# EAGLE design Lora-Breakout-SMD (EAGLE 7.3.0)
ABBREV: rf1; PROJECT: RFM12B Board
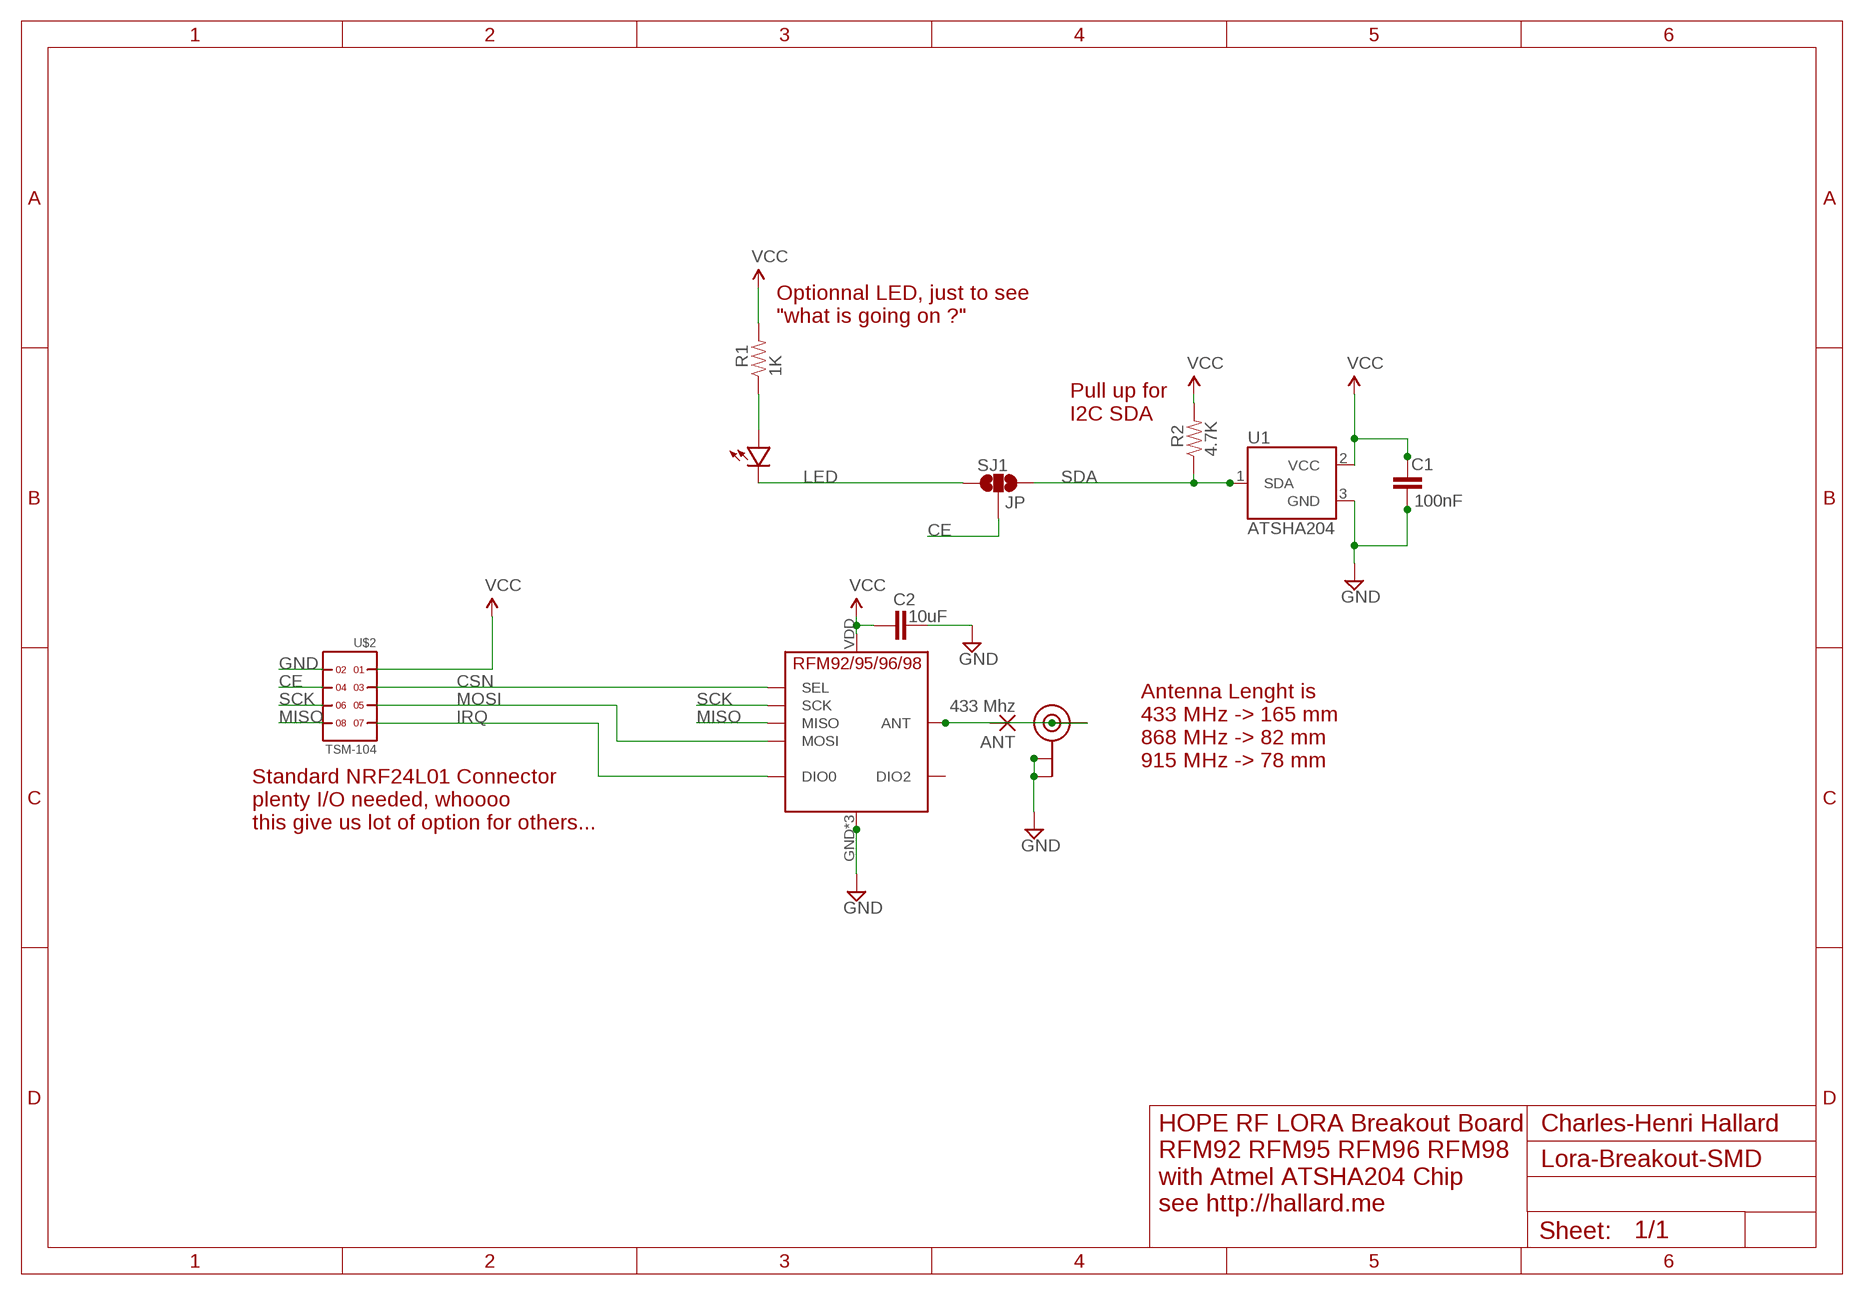
[diagram p0: schematic, sheet 1]

## Parts
ANT  433 Mhz  1,6/0,8  [1,6/0,8]
C1  100nF  CAP0805-CAP  [0805-CAP]
C2  10uF  CAP0805-CAP  [0805-CAP]
R1  1K  RESISTOR0805-RES  [0805-RES]
R2  4.7K  RESISTOR0805-RES  [0805-RES]
SJ1  JP  JUMPER-PAD-3-NOYES_SILK  [PAD-JUMPER-3-NO_YES_SILK]
U1  ATSHA204  ATSHA204-TSU  [SOT23-3]
U$1  LED0805-LARGE  [0805-LED-LARGEPADS]
U$2  TSM-104  [TSM-104]
U$3  RFM95  [RFM95]
U-FL  U.FL  [U.FL]

## Nets
CE: SJ1.2 U$2.4
CSN: U$2.3 U$3.NSS(SEL)
GND [power]: C1.2 C2.2 U1.3(GND) U$2.2 U$3.GND U$3.GND1(GND) U$3.GND2(GND) U-FL.1(GND) U-FL.2(GND)
IRQ: U$2.7 U$3.DIO0
LED: SJ1.1 U$1.MINUS
MISO: U$2.8 U$3.MISO
MOSI: U$2.5 U$3.MOSI
N$1: ANT.1(P) U$3.ANT U-FL.3(SIGNAL)
N$2: R1.1 U$1.PLUS
SCK: U$2.6 U$3.SCK
SDA: R2.1 SJ1.3 U1.1(SDA)
VCC [power]: C1.1 C2.1 R1.2 R2.2 U1.2(VCC) U$2.1 U$3.VDD(VCC)
Unconnected: U$3.DIO2

## Notes on the sheet
- Optionnal LED, just to see
  "what is going on ?"
- Pull up for
  I2C SDA
- Antenna Lenght is
  433 MHz -> 165 mm
  868 MHz -> 82 mm
  915 MHz -> 78 mm
- Standard NRF24L01 Connector
  plenty I/O needed, whoooo
  this give us lot of option for others...
- Charles-Henri Hallard
- HOPE RF LORA Breakout Board
  RFM92 RFM95 RFM96 RFM98 
  with Atmel ATSHA204 Chip 
  see http://hallard.me

## Library data of the parts
ANT = JeeLabs:1,6/0,8: THROUGH-HOLE PAD
C1 C2 = _c2h:CAP: Capacitor Standard 0603 ceramic capacitor, and 0.1" leaded capacitor.
R1 R2 = _c2h:RESISTOR: Resistor Basic schematic elements and footprints for 0603, 1206, and PTH resistors.
SJ1 = SparkFun-Passives:JUMPER-PAD-3-NO
U1 = SparkFun-DigitalIC:ATSHA204: Atmel ATSHA204 The Atmel ATSHA204 is an optimized authentication chip that includes a 4.5Kb EEPROM. This array can be used for storage of keys, miscellaneous read/write, read-only, password or secret data, and consumption tracking. Access to the various sections of memory can be restricted in a variety of ways and then the configuration locked to prevent changes.
U$1 = _c2h:LED
U$2 = _c2h:TSM-104
U$3 = _c2h:RFM95
U-FL = microbuilder:U.FL: U.FL Antenna Connector

## Net classes
1 power: width 0.203 mm, drill 0.305 mm, clearance 0.152 mm

## Board
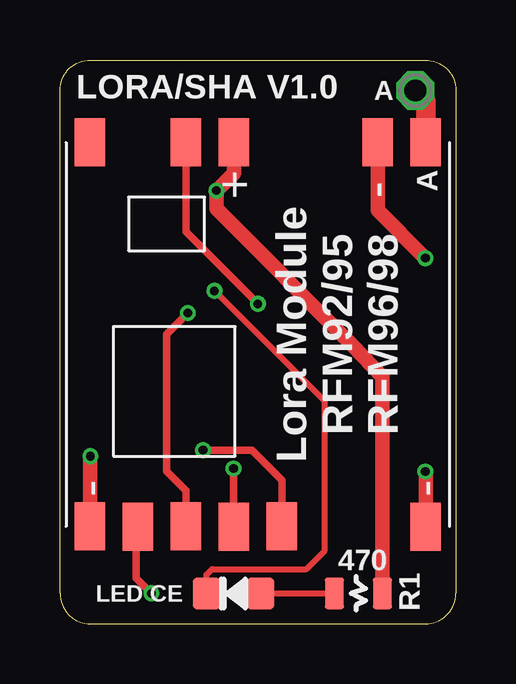
[diagram p1: board, top side]
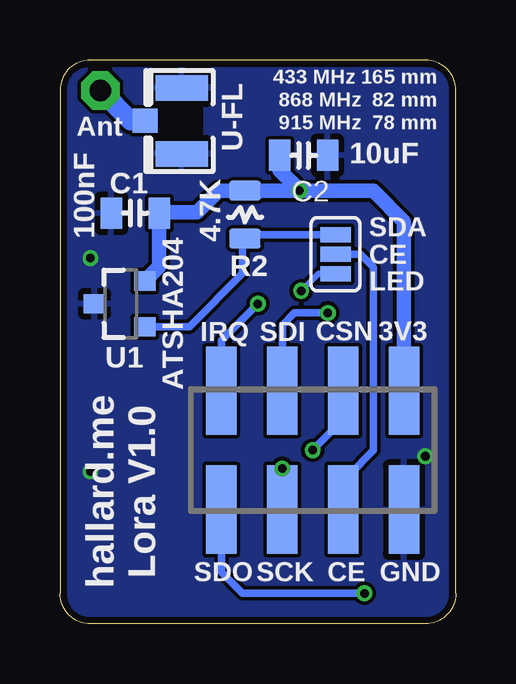
[diagram p2: board, bottom side, seen from below]

Size 16.51 x 23.5 mm. Coordinates in mm from the lower left corner, seen from the top.
Outline: 0,22.23 0,1.27 arc90 1.27,0 15.24,0 arc90 16.51,1.27 16.51,22.23
Outline: 0,22.23 0,22.28
Outline: 16.51,22.28 16.51,22.23
Outline: 0,22.23 arc-90 1.27,23.5 15.24,23.5 arc-90 16.51,22.23
Copper layers (1*16): Top 0.035mm / dielectric 1.5mm / Bottom 0.035mm
Design rules "SeeedStudio_2layer_DRU_no_angle_20140221": minimum track width 6mil, minimum drill 12mil, track to track 6mil, track to pad 6mil, pad to pad 6mil, via to via 6mil, smd to smd 0mil, copper to edge 10mil, drill to drill 10mil, minimum pad ring 10mil, minimum via ring 6mil, stop-mask expansion 2mil, vias tented up to drill 100mil, thermal gap 10mil

### Footprints (pad centres in the part's own frame; a part is rotated, then mirrored left to right if it is on the bottom)
1,6/0,8 = drill 0.9 pad 1.6 octagon: 1 0,0
0805-CAP = smd 0.902 x 1.3: 1 -1,0; 2 1,0
0805-RES = smd 0.8 x 1.3: 1 -1,0; 2 1,0
PAD-JUMPER-3-NO_YES_SILK = smd 0.635 x 1.27: 1 -0.813,0; 2 0,0; 3 0.813,0
SOT23-3 = smd 0.8 x 0.9: 1 -0.95,-1; 2 0.95,-1; 3 0,1.1
0805-LED-LARGEPADS = smd 1.156 x 1.3: MINUS -1.127,0; PLUS 1.127,0
TSM-104 = smd 1.27 x 3.683: 1 -3.81,-2.477; 2 -3.81,2.477; 3 -1.27,-2.477; 4 -1.27,2.477; 5 1.27,-2.477; 6 1.27,2.477; 7 3.81,-2.477; 8 3.81,2.477
RFM95 = smd 2 x 1.27: ANT 5.777,-7; DIO0 5.777,3; DIO2 5.779,7; GND 5.777,-5; GND1 -10.223,7; GND2 -10.23,-7; MISO -10.23,5; MOSI -10.225,3; NSS -10.223,-1; SCK -10.23,1.012; VDD 5.777,1
U.FL = smd 2.2 x 1.05: 1 0,1.375; 2 0,-1.375 | smd 1.05 x 1: 3 1.525,0

### Placement (x,y rotation side)
ANT  14.82,22.23 0 top
C1  13.37,17.11 180 bottom
C2  6.35,19.53 0 bottom
R1  12.45,1.27 0 top
R2  8.79,17.05 90 bottom
SJ1  5.02,15.4 90 bottom
U1  13.97,13.34 90 bottom
U$1  7.24,1.27 0 top
U$2  5.97,7.24 180 bottom
U$3  8.26,14.29 90 top
U-FL  11.43,20.95 180 bottom

### Tracks (layer width: path | path; a pad name or v marks a point on that pad's centre or on a via)
CE
  Bottom 0.305: U$2.4 4.7,5.46 4.45,5.71 4.45,6.22 3.43,7.24 3.43,14.86 3.97,15.4 SJ1.2
CSN  (via drill 0.36)
  Top 0.305: v5.97,7.24 8,7.24 9.26,5.99 U$3.NSS
  Bottom 0.305: U$2.3 4.7,8.51 v5.97,7.24
GND  (via drill 0.36)
  Top 0.61: U$3.GND2 15.26,6.33 v15.24,6.35 | U$3.GND 13.26,17.23 v15.24,15.24 | U$3.GND1 1.25,6.97 v1.27,6.99
  pour Bottom: -1.08,-1.08 -1.08,23.86 17.84,23.86 17.84,-1.08
IRQ  (via drill 0.36)
  Top 0.305: v8.26,13.34 5.25,16.34 U$3.DIO0
  Bottom 0.305: U$2.7 9.78,11.81 v8.26,13.34
LED  (via drill 0.36)
  Top 0.254: U$1.MINUS 6.11,2.05 6.35,2.29 10.29,2.29 11.05,3.05 11.05,9.27 v6.45,13.88
  Bottom 0.254: v6.45,13.88 5.71,14.61 5.26,14.61 SJ1.1
MISO  (via drill 0.36)
  Top 0.305: 3.17,4.14 U$3.MISO 3.17,3.98 3.17,1.91 v3.81,1.27
  Bottom 0.305: U$2.8 9.78,2.16 8.89,1.27 v3.81,1.27
MOSI  (via drill 0.36)
  Top 0.305: 5.08,4.45 5.25,4.27 U$3.MOSI 5.25,5.54 4.45,6.35 4.45,12.06 v5.33,12.95
  Bottom 0.305: v5.33,12.95 6.73,12.95 7.24,12.45 U$2.5
N$1
  Top 0.813: U$3.ANT 15.26,21.79 ANT.1
  Bottom 0.813: U-FL.3 13.55,20.95 ANT.1
N$2
  Top 0.254: U$1.PLUS R1.1
SCK  (via drill 0.36)
  Top 0.305: 7.24,4.32 U$3.SCK v7.24,6.48
  Bottom 0.305: v7.24,6.48 U$2.6
SDA
  Bottom 0.305: SJ1.3 8.96,16.21 R2.1 8.89,16.14 8.89,14.61 11.11,12.38 U1.1
VCC  (via drill 0.36)
  Top 0.61: R1.2 13.45,10.3 12.21,11.6 6.53,17.29 v6.53,18.05 7.25,18.78 U$3.VDD
  Bottom 0.61: U$2.1 2.16,16.76 3.44,18.05 v6.53,18.05 | U1.2 12.37,14.89 C1.1 12.34,17.14 10.79,17.14 9.89,18.05 R2.2 v6.53,18.05 | v6.53,18.05 6.51,18.07 7.35,18.91 C2.1

### Text on the board
tNames: LORA/SHA V1.0 | A | Lora Module / RFM92/95 / RFM96/98 | 470 | LED CE | R1
bNames: 433 MHz 165 mm | 868 MHz 82 mm | 915 MHz 78 mm | Ant | 100nF | SDA | CE | LED | 3V3 | CSN | SDI | IRQ | hallard.me / Lora V1.0 | GND | CE | SCK | SDO